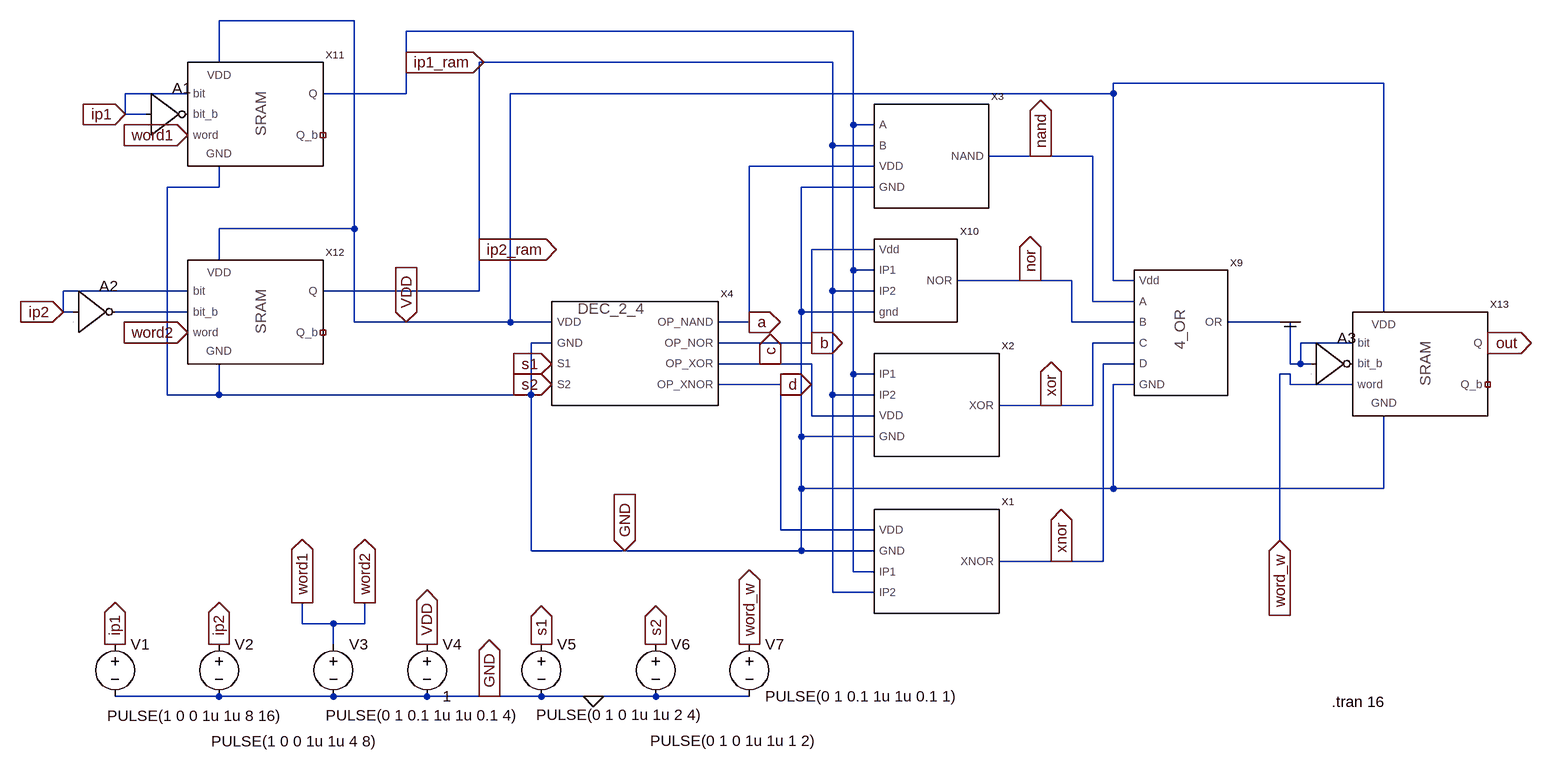
[diagram p0: schematic microcontroller.asc]
microcontroller.asc, the LTspice schematic file:
Version 4
SHEET 1 984 984
WIRE -960 -272 -1168 -272
WIRE -192 -256 -880 -256
WIRE -1168 -208 -1168 -272
WIRE -880 -208 -880 -256
WIRE -224 -208 -768 -208
WIRE 624 -176 208 -176
WIRE -1216 -160 -1312 -160
WIRE -880 -160 -880 -208
WIRE -880 -160 -1008 -160
WIRE 208 -160 208 -176
WIRE 208 -160 -720 -160
WIRE -1312 -128 -1312 -160
WIRE -1280 -128 -1312 -128
WIRE -192 -112 -192 -256
WIRE -160 -112 -192 -112
WIRE -224 -80 -224 -208
WIRE -160 -80 -224 -80
WIRE 96 -64 16 -64
WIRE 176 -64 96 -64
WIRE -160 -48 -352 -48
WIRE -1168 -16 -1168 -48
WIRE -1168 -16 -1248 -16
WIRE -160 -16 -272 -16
WIRE -960 48 -960 -272
WIRE -960 48 -1168 48
WIRE -768 80 -768 -208
WIRE -160 80 -256 80
WIRE -1168 96 -1168 48
WIRE -192 112 -192 -112
WIRE -160 112 -192 112
WIRE 80 128 -32 128
WIRE 144 128 80 128
WIRE 208 128 208 -160
WIRE 240 128 208 128
WIRE -1216 144 -1408 144
WIRE -768 144 -768 80
WIRE -768 144 -1008 144
WIRE -224 144 -224 -80
WIRE -160 144 -224 144
WIRE 176 160 176 -64
WIRE 240 160 176 160
WIRE -1408 176 -1408 144
WIRE -1392 176 -1408 176
WIRE -1216 176 -1328 176
WIRE -272 176 -272 -16
WIRE -160 176 -272 176
WIRE 624 176 624 -176
WIRE -960 192 -960 48
WIRE -880 192 -960 192
WIRE -720 192 -720 -160
WIRE -720 192 -880 192
WIRE -656 192 -720 192
WIRE -352 192 -352 -48
WIRE -352 192 -400 192
WIRE 144 192 144 128
WIRE 240 192 144 192
WIRE 480 192 384 192
WIRE -656 224 -688 224
WIRE -256 224 -256 80
WIRE -256 224 -400 224
WIRE 240 224 176 224
WIRE 576 224 496 224
WIRE -320 256 -400 256
WIRE -256 256 -320 256
WIRE 240 256 192 256
WIRE 480 256 480 192
WIRE 496 256 496 224
WIRE 496 256 480 256
WIRE 512 256 496 256
WIRE -192 272 -192 112
WIRE -160 272 -192 272
WIRE 480 272 464 272
WIRE -304 288 -400 288
WIRE 240 288 208 288
WIRE 480 288 480 272
WIRE 576 288 480 288
WIRE -1248 304 -1248 -16
WIRE -1168 304 -1168 256
WIRE -1168 304 -1248 304
WIRE -688 304 -688 224
WIRE -688 304 -1168 304
WIRE -224 304 -224 144
WIRE -160 304 -224 304
WIRE 112 320 32 320
WIRE 176 320 176 224
WIRE 176 320 112 320
WIRE -256 336 -256 256
WIRE -160 336 -256 336
WIRE -272 368 -272 176
WIRE -160 368 -272 368
WIRE -272 448 -272 368
WIRE 208 448 208 288
WIRE 208 448 -272 448
WIRE 624 448 624 336
WIRE 624 448 208 448
WIRE -304 512 -304 288
WIRE -160 512 -304 512
WIRE 464 528 464 272
WIRE -688 544 -688 304
WIRE -544 544 -688 544
WIRE -272 544 -272 448
WIRE -272 544 -544 544
WIRE -160 544 -272 544
WIRE 128 560 32 560
WIRE 192 560 192 256
WIRE 192 560 128 560
WIRE -192 576 -192 272
WIRE -160 576 -192 576
WIRE -224 608 -224 304
WIRE -160 608 -224 608
WIRE -1040 656 -1040 624
WIRE -992 656 -1040 656
WIRE -944 656 -944 624
WIRE -944 656 -992 656
WIRE -992 688 -992 656
WIRE -1168 768 -1328 768
WIRE -992 768 -1168 768
WIRE -848 768 -992 768
WIRE -752 768 -848 768
WIRE -672 768 -752 768
WIRE -592 768 -672 768
WIRE -496 768 -592 768
WIRE -352 768 -496 768
FLAG 96 -64 nand
IOPIN 96 -64 Out
FLAG 80 128 nor
IOPIN 80 128 Out
FLAG 112 320 xor
IOPIN 112 320 Out
FLAG 128 560 xnor
IOPIN 128 560 Out
FLAG -352 192 a
IOPIN -352 192 Out
FLAG -256 224 b
IOPIN -256 224 Out
FLAG -320 256 c
IOPIN -320 256 Out
FLAG -304 288 d
IOPIN -304 288 Out
FLAG -1216 -96 word1
IOPIN -1216 -96 In
FLAG -768 80 ip2_ram
IOPIN -768 80 Out
FLAG -880 -208 ip1_ram
IOPIN -880 -208 Out
FLAG 784 224 out
IOPIN 784 224 Out
FLAG 480 192 com
IOPIN 480 192 Out
FLAG 464 528 word_w
IOPIN 464 528 In
FLAG -1312 -128 ip1
IOPIN -1312 -128 In
FLAG -1408 176 ip2
IOPIN -1408 176 In
FLAG -656 256 s1
IOPIN -656 256 In
FLAG -656 288 s2
IOPIN -656 288 In
FLAG -544 544 GND
IOPIN -544 544 In
FLAG -880 192 VDD
IOPIN -880 192 In
FLAG -1216 208 word2
IOPIN -1216 208 In
FLAG -592 768 0
FLAG -752 768 GND
IOPIN -752 768 Out
FLAG -1328 688 ip1
IOPIN -1328 688 Out
FLAG -1168 688 ip2
IOPIN -1168 688 Out
FLAG -1040 624 word1
IOPIN -1040 624 Out
FLAG -944 624 word2
IOPIN -944 624 Out
FLAG -848 688 VDD
IOPIN -848 688 Out
FLAG -672 688 s1
IOPIN -672 688 Out
FLAG -496 688 s2
IOPIN -496 688 Out
FLAG -352 688 word_w
IOPIN -352 688 Out
SYMBOL XNOR -48 560 R0
SYMATTR InstName X1
SYMBOL XOR -64 320 R0
SYMATTR InstName X2
SYMBOL NAND -80 -64 R0
SYMATTR InstName X3
SYMBOL DEC_2_4 -528 240 R0
SYMATTR InstName X4
SYMBOL Digital\\inv -1280 -192 R0
SYMATTR InstName A1
SYMBOL Digital\\inv -1392 112 R0
SYMATTR InstName A2
SYMBOL Digital\\inv 512 192 R0
SYMATTR InstName A3
SYMBOL OR_4IP 272 192 R0
SYMATTR InstName X9
SYMBOL voltage -1328 672 R0
WINDOW 123 0 0 Left 2
WINDOW 39 0 0 Left 2
WINDOW 3 -12 126 Left 2
SYMATTR Value PULSE(1 0 0 1u 1u 8 16)
SYMATTR InstName V1
SYMBOL voltage -1168 672 R0
WINDOW 123 0 0 Left 2
WINDOW 39 0 0 Left 2
WINDOW 3 -12 165 Left 2
SYMATTR Value PULSE(1 0 0 1u 1u 4 8)
SYMATTR InstName V2
SYMBOL voltage -992 672 R0
WINDOW 123 0 0 Left 2
WINDOW 39 0 0 Left 2
WINDOW 3 -12 125 Left 2
SYMATTR Value PULSE(0 1 0.1 1u 1u 0.1 4)
SYMATTR InstName V3
SYMBOL voltage -848 672 R0
WINDOW 123 0 0 Left 2
WINDOW 39 0 0 Left 2
SYMATTR InstName V4
SYMATTR Value 1
SYMBOL voltage -672 672 R0
WINDOW 3 -8 124 Left 2
WINDOW 123 0 0 Left 2
WINDOW 39 0 0 Left 2
SYMATTR Value PULSE(0 1 0 1u 1u 2 4)
SYMATTR InstName V5
SYMBOL voltage -496 672 R0
WINDOW 3 -9 164 Left 2
WINDOW 123 0 0 Left 2
WINDOW 39 0 0 Left 2
SYMATTR Value PULSE(0 1 0 1u 1u 1 2)
SYMATTR InstName V6
SYMBOL voltage -352 672 R0
WINDOW 123 0 0 Left 2
WINDOW 39 0 0 Left 2
SYMATTR InstName V7
SYMATTR Value PULSE(0 1 0.1 1u 1u 0.1 1)
SYMBOL nor -144 112 R0
SYMATTR InstName X10
SYMBOL sram -1104 -128 R0
SYMATTR InstName X11
SYMBOL sram -1104 176 R0
SYMATTR InstName X12
SYMBOL sram 688 256 R0
SYMATTR InstName X13
TEXT 544 776 Left 2 !.tran 16

The netlist it stands for:
* microcontroller.asc
XX1 ip1_ram ip2_ram xnor d 0 XNOR  ; pins IP1 IP2 XNOR VDD GND
XX2 ip1_ram ip2_ram c 0 xor XOR  ; pins IP1 IP2 VDD GND XOR
XX3 ip1_ram ip2_ram a 0 nand NAND  ; pins A B VDD GND NAND
XX4 VDD 0 s1 s2 a b c d DEC_2_4  ; pins VDD GND S1 S2 OP_NAND OP_NOR OP_XOR OP_XNOR
A1 ip1 0 0 0 0 P001 0 0 BUF
A2 ip2 0 0 0 0 N001 0 0 BUF
A3 com 0 0 0 0 P002 0 0 BUF
XX9 nand nor xor xnor VDD 0 com OR_4IP  ; pins A B C D Vdd GND OR
V1 ip1 0 PULSE(1 0 0 1u 1u 8 16)
V2 ip2 0 PULSE(1 0 0 1u 1u 4 8)
V3 word2 0 PULSE(0 1 0.1 1u 1u 0.1 4)
V4 VDD 0 1
V5 s1 0 PULSE(0 1 0 1u 1u 2 4)
V6 s2 0 PULSE(0 1 0 1u 1u 1 2)
V7 word_w 0 PULSE(0 1 0.1 1u 1u 0.1 1)
XX10 ip1_ram ip2_ram b 0 nor nor  ; pins IP1 IP2 Vdd gnd NOR
XX11 ip1 P001 word2 VDD 0 ip1_ram NC_01 sram  ; pins bit bit_b word VDD GND Q Q_b
XX12 ip2 N001 word2 VDD 0 ip2_ram NC_02 sram  ; pins bit bit_b word VDD GND Q Q_b
XX13 com P002 word_w VDD 0 out NC_03 sram  ; pins bit bit_b word VDD GND Q Q_b
.tran 16
.backanno
.end